# EAGLE design PCB-CMB-1 (EAGLE 6.4)

## Sheet 1 of 2
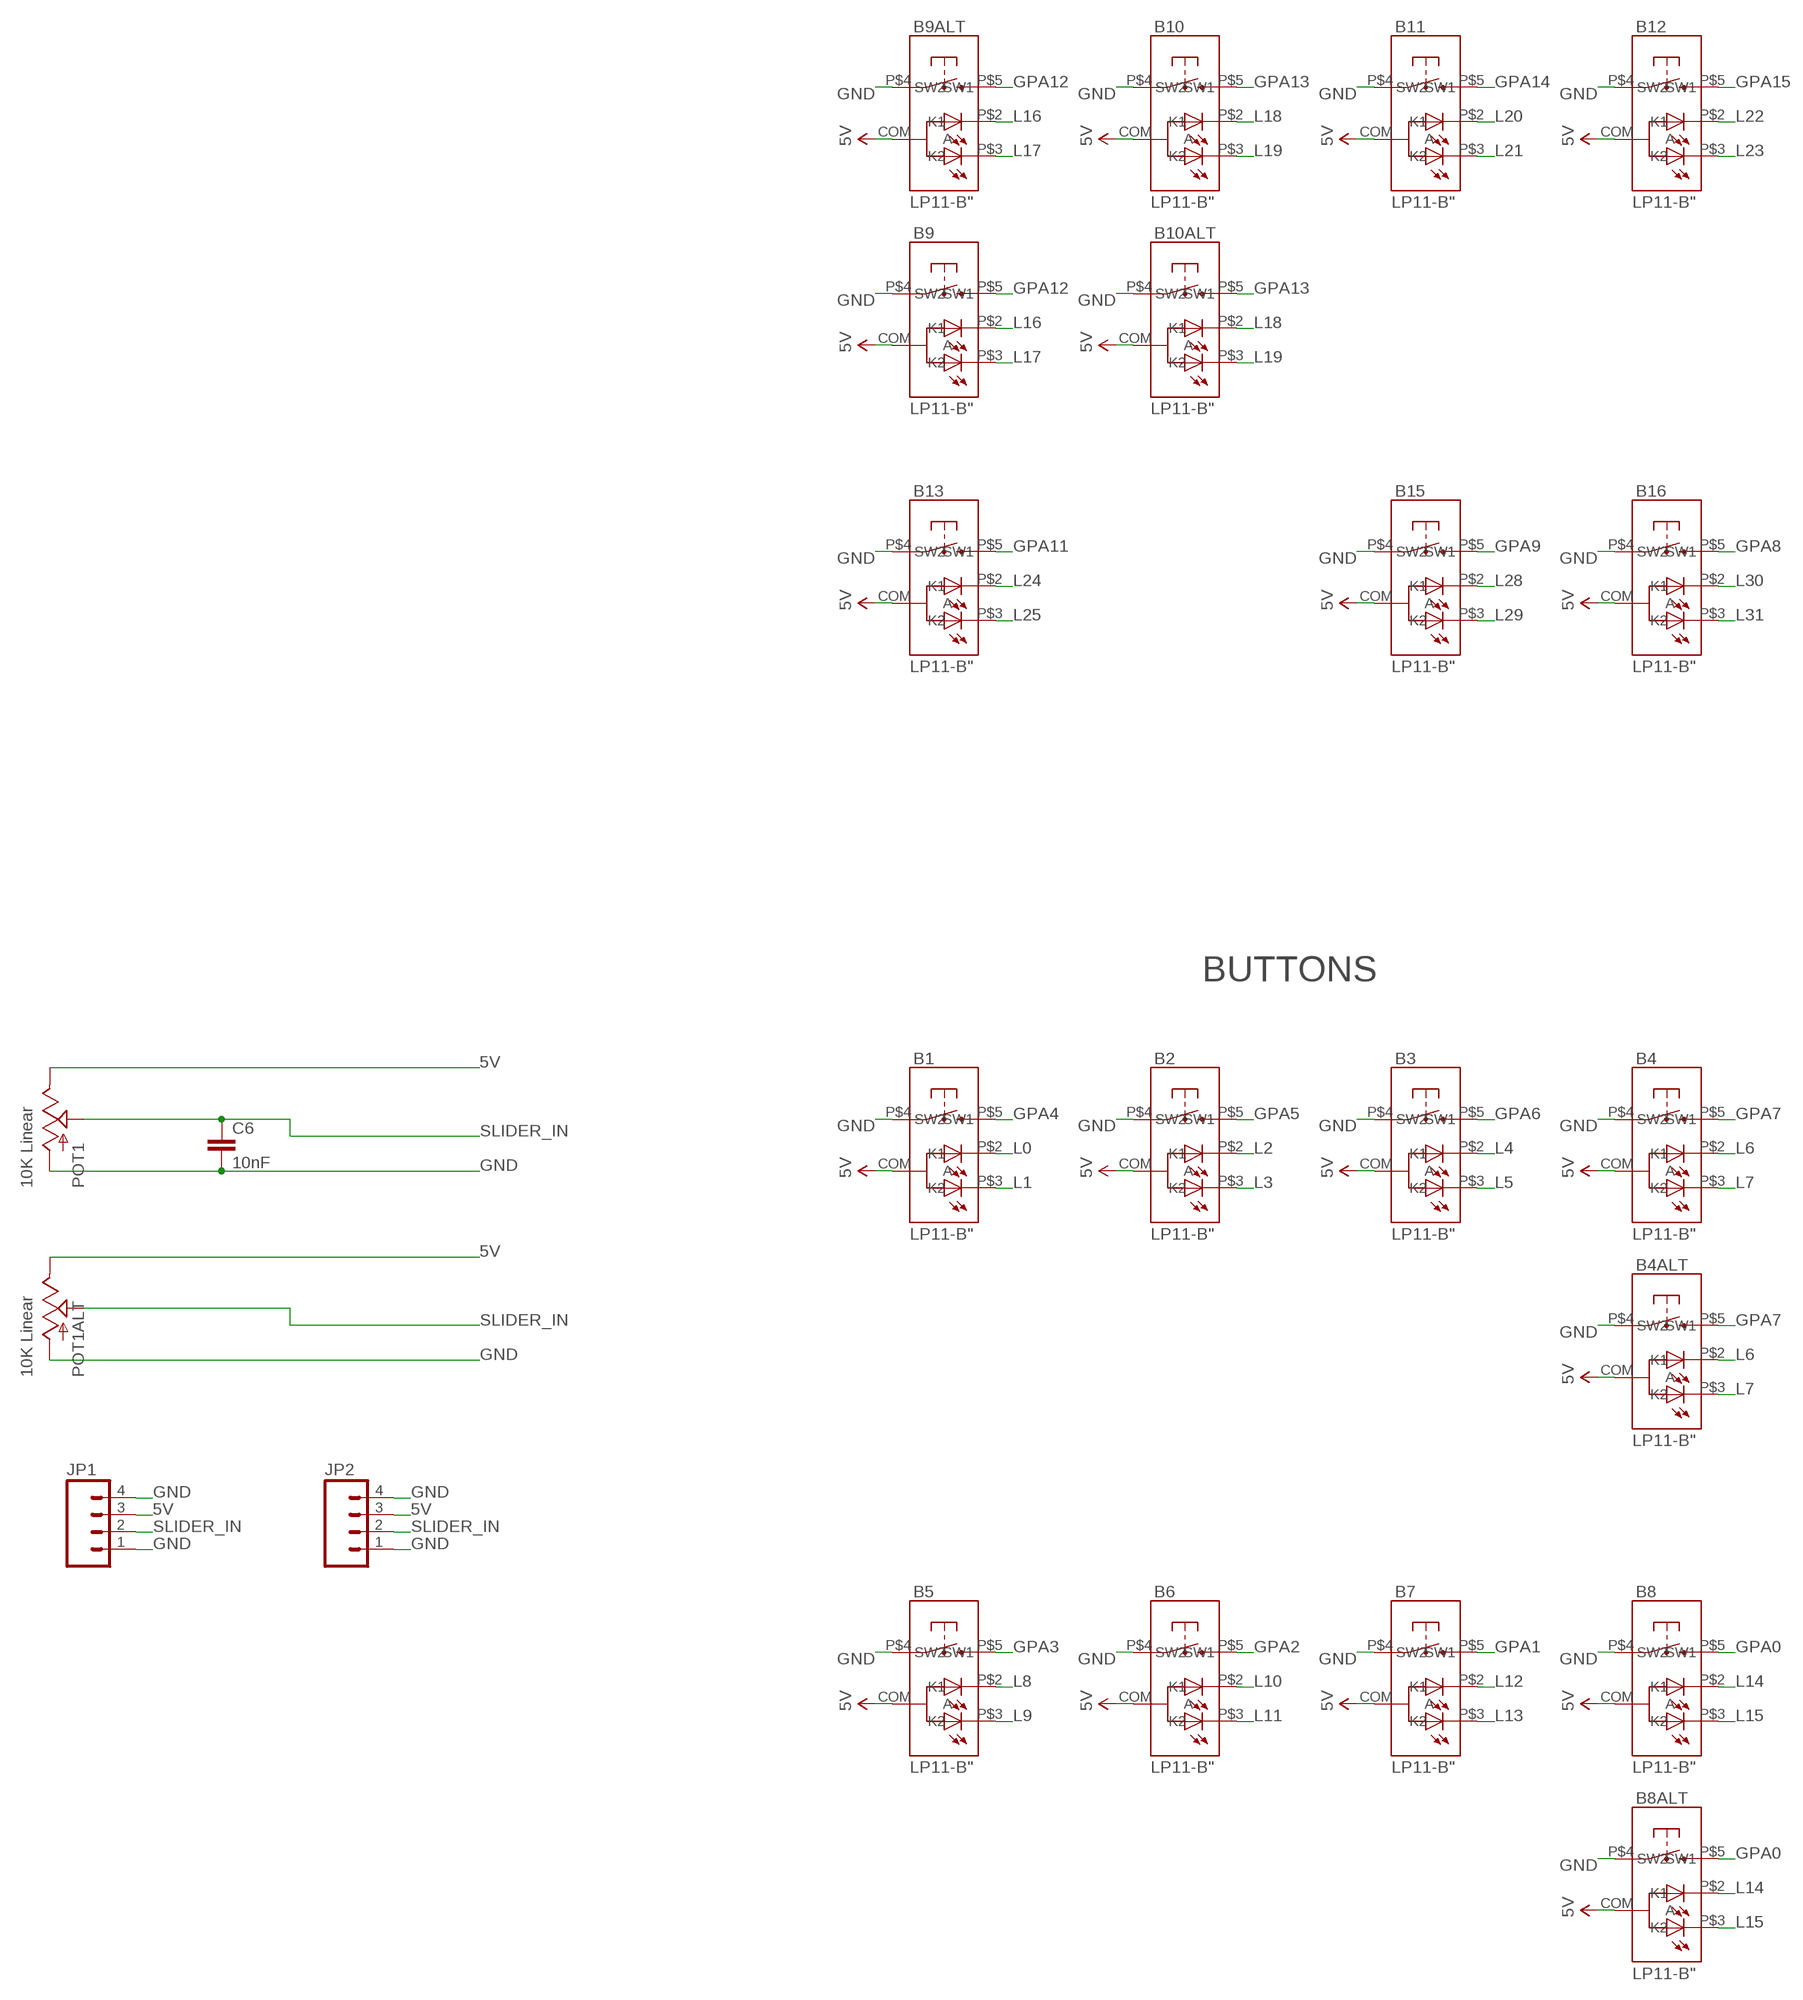
[diagram p0: schematic, sheet 1, part 1 of 2]
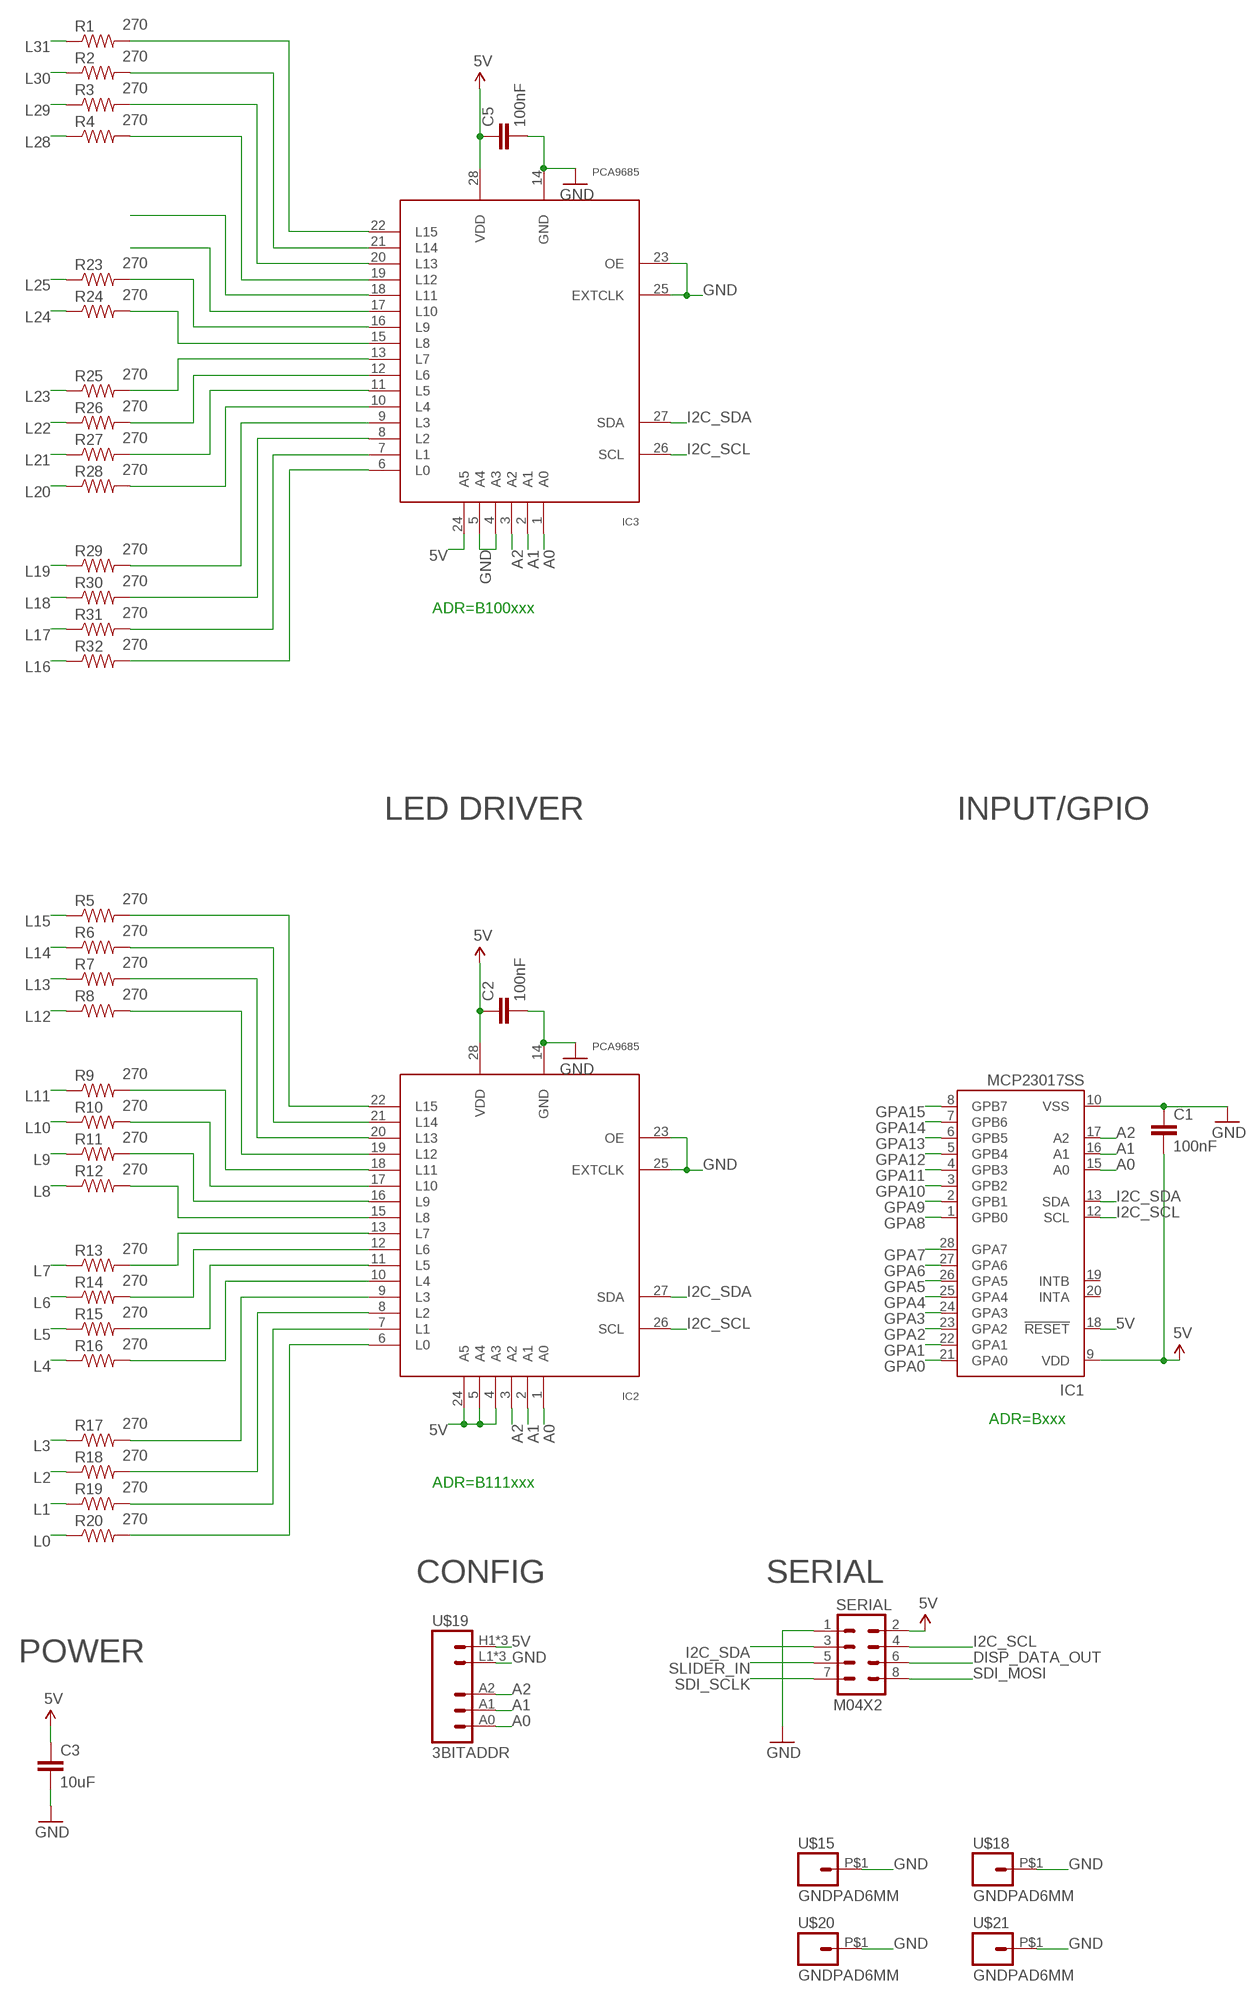
[diagram p1: schematic, sheet 1, part 2 of 2]

### Parts
B1  LP11-B"  [LP11]
B2  LP11-B"  [LP11]
B3  LP11-B"  [LP11]
B4  LP11-B"  [LP11]
B4ALT  LP11-B"  [LP11]
B5  LP11-B"  [LP11]
B6  LP11-B"  [LP11]
B7  LP11-B"  [LP11]
B8  LP11-B"  [LP11]
B8ALT  LP11-B"  [LP11]
B9  LP11-B"  [LP11]
B9ALT  LP11-B"  [LP11]
B10  LP11-B"  [LP11]
B10ALT  LP11-B"  [LP11]
B11  LP11-B"  [LP11]
B12  LP11-B"  [LP11]
B13  LP11-B"  [LP11]
B15  LP11-B"  [LP11]
B16  LP11-B"  [LP11]
C1  100nF  CAP0603-CAP  [0603-CAP]
C2  100nF  CAP0603-CAP  [0603-CAP]
C3  10uF  CAP0805  [0805]
C5  100nF  CAP0603-CAP  [0603-CAP]
C6  10nF  CAP0603-CAP  [0603-CAP]
IC1  MCP23017SS  [SSOP28]
IC2  PCA9685  [TSSOP28]
IC3  PCA9685  [TSSOP28]
JP1  M04PTH  [1X04]
JP2  M04PTH  [1X04]
POT1  10K Linear  SLIDER20  [SLIDER20]
POT1ALT  10K Linear  SLIDER20  [SLIDER20]
R1  270  RESISTOR0603-RES  [0603-RES]
R2  270  RESISTOR0603-RES  [0603-RES]
R3  270  RESISTOR0603-RES  [0603-RES]
R4  270  RESISTOR0603-RES  [0603-RES]
R5  270  RESISTOR0603-RES  [0603-RES]
R6  270  RESISTOR0603-RES  [0603-RES]
R7  270  RESISTOR0603-RES  [0603-RES]
R8  270  RESISTOR0603-RES  [0603-RES]
R9  270  RESISTOR0603-RES  [0603-RES]
R10  270  RESISTOR0603-RES  [0603-RES]
R11  270  RESISTOR0603-RES  [0603-RES]
R12  270  RESISTOR0603-RES  [0603-RES]
R13  270  RESISTOR0603-RES  [0603-RES]
R14  270  RESISTOR0603-RES  [0603-RES]
R15  270  RESISTOR0603-RES  [0603-RES]
R16  270  RESISTOR0603-RES  [0603-RES]
R17  270  RESISTOR0603-RES  [0603-RES]
R18  270  RESISTOR0603-RES  [0603-RES]
R19  270  RESISTOR0603-RES  [0603-RES]
R20  270  RESISTOR0603-RES  [0603-RES]
R23  270  RESISTOR0603-RES  [0603-RES]
R24  270  RESISTOR0603-RES  [0603-RES]
R25  270  RESISTOR0603-RES  [0603-RES]
R26  270  RESISTOR0603-RES  [0603-RES]
R27  270  RESISTOR0603-RES  [0603-RES]
R28  270  RESISTOR0603-RES  [0603-RES]
R29  270  RESISTOR0603-RES  [0603-RES]
R30  270  RESISTOR0603-RES  [0603-RES]
R31  270  RESISTOR0603-RES  [0603-RES]
R32  270  RESISTOR0603-RES  [0603-RES]
SERIAL  M04X2  [2X4]
U$15  GNDPAD6MM  [3.2MMPAD6MM]
U$18  GNDPAD6MM  [3.2MMPAD6MM]
U$19  3BITADDR  [3BITADDR]
U$20  GNDPAD6MM  [3.2MMPAD6MM]
U$21  GNDPAD6MM  [3.2MMPAD6MM]

### Nets
5V [Power]: B1.COM(A) B2.COM(A) B3.COM(A) B4.COM(A) B4ALT.COM(A) B5.COM(A) B6.COM(A) B7.COM(A) B8.COM(A) B8ALT.COM(A) B9.COM(A) B9ALT.COM(A) B10.COM(A) B10ALT.COM(A) B11.COM(A) B12.COM(A) B13.COM(A) B15.COM(A) B16.COM(A) C1.2 C2.1 C3.1 C5.1 IC1.9(VDD) IC1.18(!RESET) IC2.4(A3) IC2.5(A4) IC2.24(A5) IC2.28(VDD) IC3.24(A5) IC3.28(VDD) JP1.3 JP2.3 POT1.1(E) POT1ALT.1(E) SERIAL.2 U$19.H1(VCC) U$19.H2(VCC) U$19.H3(VCC)
A0: IC1.15(A0) IC2.1(A0) IC3.1(A0) U$19.A0
A1: IC1.16(A1) IC2.2(A1) IC3.2(A1) U$19.A1
A2: IC1.17(A2) IC2.3(A2) IC3.3(A2) U$19.A2
DISP_DATA_OUT: SERIAL.6
GND [Power]: B1.P$4(SW1) B2.P$4(SW1) B3.P$4(SW1) B4.P$4(SW1) B4ALT.P$4(SW1) B5.P$4(SW1) B6.P$4(SW1) B7.P$4(SW1) B8.P$4(SW1) B8ALT.P$4(SW1) B9.P$4(SW1) B9ALT.P$4(SW1) B10.P$4(SW1) B10ALT.P$4(SW1) B11.P$4(SW1) B12.P$4(SW1) B13.P$4(SW1) B15.P$4(SW1) B16.P$4(SW1) C1.1 C2.2 C3.2 C5.2 C6.2 IC1.10(VSS) IC2.14(GND) IC2.23(OE) IC2.25(EXTCLK) IC3.4(A3) IC3.5(A4) IC3.14(GND) IC3.23(OE) IC3.25(EXTCLK) JP1.1 JP1.4 JP2.1 JP2.4 POT1.3(A) POT1ALT.3(A) SERIAL.1 U$15.P$1 U$18.P$1 U$19.L1(GND) U$19.L2(GND) U$19.L3(GND) U$20.P$1 U$21.P$1
GPA0: B8.P$5(SW2) B8ALT.P$5(SW2) IC1.21(GPA0)
GPA1: B7.P$5(SW2) IC1.22(GPA1)
GPA2: B6.P$5(SW2) IC1.23(GPA2)
GPA3: B5.P$5(SW2) IC1.24(GPA3)
GPA4: B1.P$5(SW2) IC1.25(GPA4)
GPA5: B2.P$5(SW2) IC1.26(GPA5)
GPA6: B3.P$5(SW2) IC1.27(GPA6)
GPA7: B4.P$5(SW2) B4ALT.P$5(SW2) IC1.28(GPA7)
GPA8: B16.P$5(SW2) IC1.1(GPB0)
GPA9: B15.P$5(SW2) IC1.2(GPB1)
GPA10: IC1.3(GPB2)
GPA11: B13.P$5(SW2) IC1.4(GPB3)
GPA12: B9.P$5(SW2) B9ALT.P$5(SW2) IC1.5(GPB4)
GPA13: B10.P$5(SW2) B10ALT.P$5(SW2) IC1.6(GPB5)
GPA14: B11.P$5(SW2) IC1.7(GPB6)
GPA15: B12.P$5(SW2) IC1.8(GPB7)
I2C_SCL: IC1.12(SCL) IC2.26(SCL) IC3.26(SCL) SERIAL.4
I2C_SDA: IC1.13(SDA) IC2.27(SDA) IC3.27(SDA) SERIAL.3
L0: B1.P$2(K1) R20.1
L1: B1.P$3(K2) R19.1
L2: B2.P$2(K1) R18.1
L3: B2.P$3(K2) R17.1
L4: B3.P$2(K1) R16.1
L5: B3.P$3(K2) R15.1
L6: B4.P$2(K1) B4ALT.P$2(K1) R14.1
L7: B4.P$3(K2) B4ALT.P$3(K2) R13.1
L8: B5.P$2(K1) R12.1
L9: B5.P$3(K2) R11.1
L10: B6.P$2(K1) R10.1
L11: B6.P$3(K2) R9.1
L12: B7.P$2(K1) R8.1
L13: B7.P$3(K2) R7.1
L14: B8.P$2(K1) B8ALT.P$2(K1) R6.1
L15: B8.P$3(K2) B8ALT.P$3(K2) R5.1
L16: B9.P$2(K1) B9ALT.P$2(K1) R32.1
L17: B9.P$3(K2) B9ALT.P$3(K2) R31.1
L18: B10.P$2(K1) B10ALT.P$2(K1) R30.1
L19: B10.P$3(K2) B10ALT.P$3(K2) R29.1
L20: B11.P$2(K1) R28.1
L21: B11.P$3(K2) R27.1
L22: B12.P$2(K1) R26.1
L23: B12.P$3(K2) R25.1
L24: B13.P$2(K1) R24.1
L25: B13.P$3(K2) R23.1
L28: B15.P$2(K1) R4.1
L29: B15.P$3(K2) R3.1
L30: B16.P$2(K1) R2.1
L31: B16.P$3(K2) R1.1
N$1: IC3.13(L7) R25.2
N$2: IC3.12(L6) R26.2
N$3: IC3.11(L5) R27.2
N$4: IC2.13(L7) R13.2
N$5: IC2.12(L6) R14.2
N$6: IC3.10(L4) R28.2
N$7: IC2.11(L5) R15.2
N$8: IC3.9(L3) R29.2
N$9: IC2.10(L4) R16.2
N$10: IC2.9(L3) R17.2
N$11: IC2.8(L2) R18.2
N$12: IC2.7(L1) R19.2
N$13: IC3.8(L2) R30.2
N$14: IC3.7(L1) R31.2
N$15: IC3.6(L0) R32.2
N$16: IC3.15(L8) R24.2
N$17: IC3.16(L9) R23.2
N$18: IC3.17(L10)
N$19: IC2.6(L0) R20.2
N$20: IC2.15(L8) R12.2
N$21: IC2.16(L9) R11.2
N$22: IC2.17(L10) R10.2
N$23: IC2.18(L11) R9.2
N$24: IC2.19(L12) R8.2
N$25: IC2.20(L13) R7.2
N$26: IC2.21(L14) R6.2
N$27: IC2.22(L15) R5.2
N$28: IC3.18(L11)
N$29: IC3.19(L12) R4.2
N$30: IC3.20(L13) R3.2
N$31: IC3.21(L14) R2.2
N$32: IC3.22(L15) R1.2
SDI_MOSI: SERIAL.8
SDI_SCLK: SERIAL.7
SLIDER_IN: C6.1 JP1.2 JP2.2 POT1.2A(S) POT1ALT.2A(S) SERIAL.5
Unconnected: IC1.19(INTB) IC1.20(INTA)

### Notes on the sheet
- ADR=B100xxx
- BUTTONS | LED DRIVER | INPUT/GPIO
- ADR=Bxxx
- ADR=B111xxx
- CONFIG | SERIAL
- POWER

## Sheet 2 of 2

## Library data of the parts
B1-B4 B4ALT B5-B8 B8ALT B9 B9ALT B10 B10ALT B11-B13 B15 B16 = SKAARHOJ:LP11-B
C1-C3 C5 C6 = SparkFun:CAP: Capacitor Standard 0603 ceramic capacitor, and 0.1" leaded capacitor.
IC1 = microchip:MCP23017: http://ww1.microchip.com/downloads/en/DeviceDoc/21952a.pdf Source: http://ww1.microchip.com/downloads/en/DeviceDoc/21952a.pdf; MF: MICROCHIP; MPN: MCP23017-E/SS; OC_FARNELL: 1467674; OC_NEWARK: 31K2960
IC2 IC3 = wsmith:PCA9685
JP1 JP2 = SparkFun:M04: Header 4 Standard 4-pin 0.1" header. Use with straight break away headers (SKU : PRT-00116), right angle break away headers (PRT-00553), swiss pins (PRT-00743), machine pins (PRT-00117), and female headers (PRT-00115). Molex polarized connector foot print use with SKU : PRT-08231 with associated crimp pins and housings. 1MM SMD Version SKU: PRT-10208
POT1 POT1ALT = SKAARHOJ:SLIDER
R1-R20 R23-R32 = SparkFun:RESISTOR: Resistor Basic schematic elements and footprints for 0603, 1206, and PTH resistors.
SERIAL = SparkFun:M04X2
U$15 U$18 U$20 U$21 = SKAARHOJ:GNDPAD
U$19 = SKAARHOJ:3BITADDR

## Net classes
0 default: width 0.203 mm, drill 0.406 mm, clearance 0.203 mm
1 Power: width 0.406 mm, drill 0.61 mm, clearance 0.203 mm

## Board
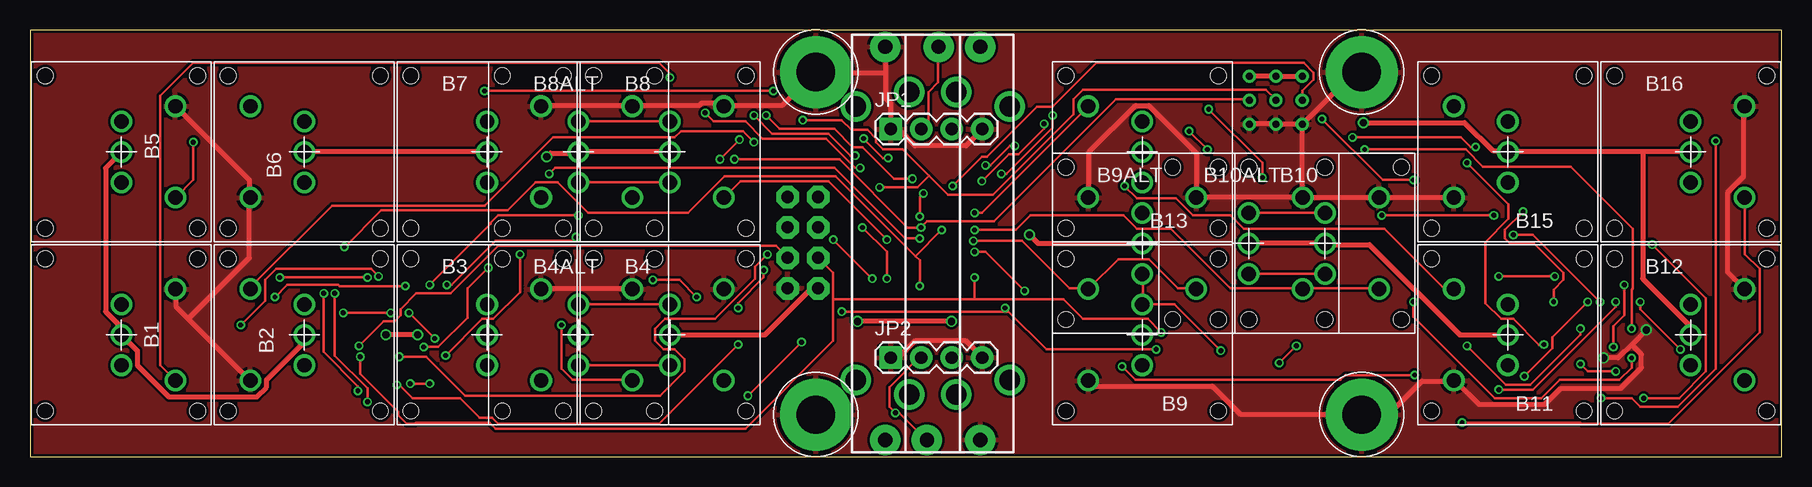
[diagram p2: board, top side]
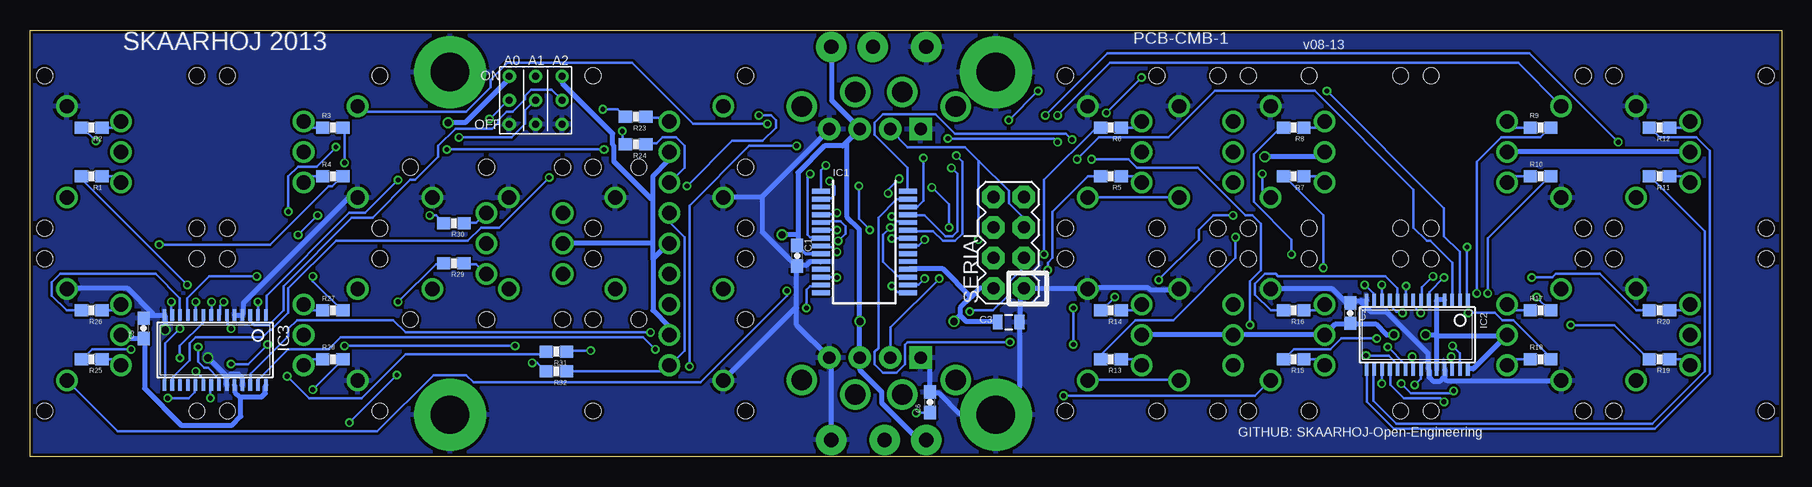
[diagram p3: board, bottom side, seen from below]

Size 146 x 35.56 mm. Coordinates in mm from the lower left corner, seen from the top.
Outline: 0,0 146,0 146,35.56 0,35.56 0,0
Copper layers (1*16): Top 0.035mm / dielectric 1.5mm / Bottom 0.035mm
Design rules "Fusion_eagle_rule_v1.1": minimum track width 6mil, minimum drill 12mil, track to track 6mil, track to pad 6mil, pad to pad 6mil, via to via 6mil, smd to smd 0mil, copper to edge 10mil, drill to drill 10mil, minimum pad ring 10mil, minimum via ring 6mil, stop-mask expansion 2mil, vias tented up to drill 100mil, thermal gap 10mil

### Footprints (pad centres in the part's own frame; a part is rotated, then mirrored left to right if it is on the bottom)
LP11 = drill 1.2: COM 0,0; P$2 0,2.54; P$3 0,-2.54; P$4 4.5,3.81; P$5 4.5,-3.81 | hole 1.3: -6.35,6.35; 6.35,6.35; 6.35,-6.35; -6.35,-6.35
0603-CAP = smd 1.1 x 1: 1 -0.85,0; 2 0.85,0
0805 = smd 0.8 x 1.2: 1 -0.9,0; 2 0.9,0
SSOP28 = smd 0.4 x 1.5: 1 -4.225,-3.625; 2 -3.575,-3.625; 3 -2.925,-3.625; 4 -2.275,-3.625; 5 -1.625,-3.625; 6 -0.975,-3.625; 7 -0.325,-3.625; 8 0.325,-3.625; 9 0.975,-3.625; 10 1.625,-3.625; 11 2.275,-3.625; 12 2.925,-3.625; 13 3.575,-3.625; 14 4.225,-3.625; 15 4.225,3.625; 16 3.575,3.625; 17 2.925,3.625; 18 2.275,3.625; 19 1.625,3.625; 20 0.975,3.625; 21 0.325,3.625; 22 -0.325,3.625; 23 -0.975,3.625; 24 -1.625,3.625; 25 -2.275,3.625; 26 -2.925,3.625; 27 -3.575,3.625; 28 -4.225,3.625
TSSOP28 = smd 0.305 x 0.991: 1 -4.225,-2.918; 2 -3.575,-2.918; 3 -2.925,-2.918; 4 -2.275,-2.918; 5 -1.625,-2.918; 6 -0.975,-2.918; 7 -0.325,-2.918; 8 0.325,-2.918; 9 0.975,-2.918; 10 1.625,-2.918; 11 2.275,-2.918; 12 2.925,-2.918; 13 3.575,-2.918; 14 4.225,-2.918; 15 4.225,2.918; 16 3.575,2.918; 17 2.925,2.918; 18 2.275,2.918; 19 1.625,2.918; 20 0.975,2.918; 21 0.325,2.918; 22 -0.325,2.918; 23 -0.975,2.918; 24 -1.625,2.918; 25 -2.275,2.918; 26 -2.925,2.918; 27 -3.575,2.918; 28 -4.225,2.918
1X04 = drill 1.016 pad 1.88 square: 1 0,0 | drill 1.016 pad 1.88: 2 2.54,0; 3 5.08,0; 4 7.62,0
SLIDER20 = drill 1.194 pad 2.54: 1 -16.383,1.74; 2A -16.383,-1.74; 3 16.383,1.74 | drill 1.702: P$1 -11.392,4.191; P$2 11.392,4.191; P$3 12.598,-4.191; P$4 -12.598,-4.191
0603-RES = smd 1.1 x 1: 1 -0.85,0; 2 0.85,0
2X4 = drill 1.016 pad 1.88 octagon: 1 -3.81,-1.27; 2 -3.81,1.27; 3 -1.27,-1.27; 4 -1.27,1.27; 5 1.27,-1.27; 6 1.27,1.27; 7 3.81,-1.27; 8 3.81,1.27
3.2MMPAD6MM = drill 3.2 pad 6: P$1 0,0
3BITADDR = drill 0.6: A0 -2.2,0; A1 0,0; A2 2.2,0; H1 -2.2,2; H2 0,2; H3 2.2,2; L1 -2.2,-2; L2 0,-2; L3 2.2,-2

### Placement (x,y rotation side)
B1  7.62,10.16 0 top
B2  22.86,10.16 180 top
B3  38.1,10.16 0 top
B4  53.34,10.16 0 top
B4ALT  45.72,10.16 0 top
B5  7.62,25.4 0 top
B6  22.86,25.4 180 top
B7  38.1,25.4 0 top
B8  53.34,25.4 0 top
B8ALT  45.72,25.4 0 top
B9  92.71,10.16 180 top
B9ALT  92.71,17.78 0 top
B10  107.95,17.78 0 top
B10ALT  101.6,17.78 0 top
B11  123.19,10.16 180 top
B12  138.43,10.16 0 top
B13  92.71,25.4 180 top
B15  123.19,25.4 180 top
B16  138.43,25.4 0 top
C1  82.04,16.75 90 bottom
C2  35.96,11.96 90 bottom
C3  64.42,11.21 0 bottom
C5  136.54,10.69 90 bottom
C6  70.97,4.54 90 bottom
IC1  76.45,17.89 270 bottom
IC2  30.37,10.16 180 bottom
IC3  130.57,8.89 180 bottom
JP1  71.75,27.3 0 top
JP2  71.75,8.26 0 top
POT1  73.03,17.78 90 top
POT1ALT  77.47,17.78 270 top
R1  140.86,23.37 180 bottom
R2  140.86,27.43 180 bottom
R3  120.76,27.43 0 bottom
R4  120.76,23.37 0 bottom
R5  55.9,23.37 180 bottom
R6  55.9,27.43 180 bottom
R7  40.66,23.37 180 bottom
R8  40.66,27.43 180 bottom
R9  20.08,27.43 0 bottom
R10  20.08,23.37 0 bottom
R11  10.18,23.37 180 bottom
R12  10.18,27.43 180 bottom
R13  55.9,8.13 180 bottom
R14  55.9,12.19 180 bottom
R15  40.66,8.13 180 bottom
R16  40.66,12.19 180 bottom
R17  20.08,12.19 0 bottom
R18  20.08,8.13 0 bottom
R19  10.18,8.13 180 bottom
R20  10.18,12.19 180 bottom
R23  95.52,28.32 180 bottom
R24  95.52,26.03 180 bottom
R25  140.86,8.13 180 bottom
R26  140.86,12.19 180 bottom
R27  120.76,12.19 0 bottom
R28  120.76,8.13 0 bottom
R29  110.68,16.13 180 bottom
R30  110.67,19.47 180 bottom
R31  102.12,8.76 180 bottom
R32  102.12,7.11 180 bottom
SERIAL  64.42,17.84 90 bottom
U$15  65.5,3.5 0 top
U$18  111,3.5 0 top
U$19  103.85,29.7 0 bottom
U$20  65.5,32.06 0 top
U$21  111,32.06 0 top

### Tracks (layer width: path | path; a pad name or v marks a point on that pad's centre or on a via)
5V  (via drill 0.61)
  Top 0.406: B16.COM 134.42,25.4 | 134.42,25.4 B15.COM 123.04,25.5 121.92,25.5 119.58,27.84 v111.15,27.84 | 134.42,25.4 134.42,14.83 138.38,10.87 138.38,10.16 B12.COM | B10ALT.COM B10.COM 108.1,17.68 111.66,17.68 119.18,10.16 B11.COM | U$19.H3 101.7,31.7 103.83,31.7 U$19.H2 104.04,31.7 105.97,31.7 U$19.H1 | B8.COM B8ALT.COM 45.62,25.3 43.38,25.3 v43.08,24.99 | B7.COM B6.COM | B5.COM 6.3,24.08 6.3,12.09 7.62,10.77 B1.COM 8.94,8.84 8.94,7.62 11.58,4.98 18.9,4.98 19.71,5.79 19.71,6.4 22.86,9.55 B2.COM | B4.COM 61.27,10.16 65.13,14.02 65.63,14.02 SERIAL.2 | v76.81,11.28 v68.99,11.28 | v32.31,10.16 v29.67,10.16 | B9ALT.COM 84.02,17.78 v83.31,18.49
  Bottom 0.305: IC1.9 81.36,16.91 C1.2
  Bottom 0.406: 128.42,4.98 128.52,4.98 128.93,5.38 128.93,5.89 IC3.24 | 128.42,4.98 126.69,4.98 126.39,5.28 126.39,5.89 IC3.28 | B12.COM 138.38,10.16 138.07,9.86 136.55,9.86 C5.1 136.45,9.65 136.45,5.69 133.4,2.64 129.13,2.64 128.42,3.35 128.42,4.98 | 93.98,16.56 92.76,17.78 B9ALT.COM | 93.98,16.56 94.08,16.46 94.08,12.19 92.76,10.87 92.76,10.16 B9.COM | 94.08,17.78 94.08,16.66 93.98,16.56 | 94.08,17.78 94.08,21.44 | 94.08,21.44 94.08,23.37 92.76,24.69 92.76,25.4 B13.COM | U$19.H3 101.6,31.6 101.6,31.09 97.43,26.92 97.43,26.01 97.33,25.91 97.33,24.59 94.18,21.44 94.08,21.44 | 94.08,17.78 B10ALT.COM | v111.15,27.84 109.73,27.84 105.97,31.6 U$19.H1 | v43.08,24.99 38.51,24.99 B7.COM | IC2.4 28.14,13.11 28.65,13.11 IC2.5 28.75,12.9 28.75,10.16 | 28.75,10.16 28.75,10.06 | 28.75,10.06 28.75,7.32 IC2.24 | IC2.28 26.11,7.32 25.7,7.32 B2.COM 23.16,10.06 28.75,10.06 | B5.COM B6.COM | 68.48,11.79 67.97,11.28 65.33,11.28 C3.1 | 68.48,11.79 68.48,12.39 67.56,13.31 | 67.56,13.31 66.85,14.02 65.73,14.02 SERIAL.2 | 67.56,13.31 69.9,15.65 72.75,15.65 IC1.18 | B4.COM B4ALT.COM B3.COM 37.19,11.07 35.97,11.07 C2.1 35.76,11.07 33.83,11.07 32.92,10.16 v32.31,10.16 | POT1.1 71.32,1.42 71.93,1.42 74.98,4.47 74.98,5.38 76.81,7.21 76.81,8.23 JP2.3 76.91,8.43 76.91,11.28 | 81.99,18.49 81.99,23.67 79.76,25.91 78.23,25.91 78.03,26.11 | 81.99,18.49 81.99,17.68 C1.2 | 78.03,26.11 JP1.3 76.91,27.43 79.15,29.67 79.15,34.14 POT1ALT.1 | 76.91,11.28 76.91,19 77.93,20.02 77.93,26.01 78.03,26.11 | v68.99,11.28 68.48,11.79 | v76.81,11.28 76.91,11.28 | v29.67,10.16 28.75,10.16 | 81.99,18.49 v83.31,18.49
A0  (via drill 0.41)
  Top 0.203: v115.32,23.06 112.78,23.06 v107.7,28.14 | v26.21,17.48 29.26,20.52 39.83,20.52 42.16,22.86 43.99,22.86 46.53,20.32 54.86,20.32 57.91,23.37 67.16,23.37 73.81,16.71 | 73.81,16.71 74.17,16.36 v74.17,14.22 | v76.91,22.55 79.35,24.99 79.76,24.99 83.92,29.16 85.24,29.16 88.9,32.82 106.17,32.82 106.98,32 106.98,31.39 106.07,30.48 106.07,29.77 U$19.A0 | 73.81,16.71 v76,18.9
  Bottom 0.203: v115.32,23.06 118.06,20.32 119.38,20.32 126.29,13.41 126.29,11.89 IC3.1 | v107.7,28.14 106.07,29.77 U$19.A0 | v26.21,17.48 26.21,13.11 IC2.1 | v74.17,14.22 73.66,13.72 72.85,13.72 IC1.15 | v76.91,22.55 76.91,19.81 v76,18.9
A1  (via drill 0.41)
  Top 0.203: v61.98,30.48 v37.9,30.48 | v64.41,28.04 67.67,28.04 68.48,27.23 69.8,27.23 70.51,26.52 70.51,26.21 71.12,25.6 72.75,25.6 74.93,23.42 | 74.93,23.42 76.5,21.84 80.26,21.84 86.97,28.55 86.97,29.77 87.78,30.58 103.02,30.58 103.83,29.77 U$19.A1 | v127,12.9 127,13.92 127.81,14.73 127.81,15.34 125.37,17.78 123.34,17.78 122.94,18.19 122.94,18.9 v124.46,20.42 | v120.5,25.81 120.09,25.81 119.28,26.62 v110.24,26.62 | v71.42,14.83 71.42,17.07 v69.39,19.1 | v70.81,22.45 73.97,22.45 74.93,23.42
  Bottom 0.203: v37.9,30.48 28.14,20.73 28.14,18.39 26.82,17.07 26.82,13.11 IC2.2 | v64.41,28.04 v61.98,30.48 | v127,12.9 127,11.89 IC3.2 | v124.46,20.42 124.46,23.37 123.65,24.18 122.12,24.18 v120.5,25.81 | v110.24,26.62 105.87,26.62 104.75,27.74 104.75,28.85 103.94,29.67 U$19.A1 | v71.42,14.83 71.93,14.33 72.75,14.33 IC1.16 | v69.39,19.1 69.39,21.03 v70.81,22.45
A2  (via drill 0.41)
  Top 0.203: v58.73,24.79 67.46,24.79 73.15,19.1 v74.27,19.1 74.78,19.61 80.37,19.61 90.53,29.77 101.6,29.77 U$19.A2
  Bottom 0.203: IC3.3 127.61,11.79 127.61,11.28 127.31,10.97 126.09,10.97 124.87,12.19 124.87,14.22 119.18,19.91 117.45,19.91 114.3,23.06 113.89,23.06 111.96,24.99 111.96,25.91 110.54,27.33 107.49,27.33 106.98,27.84 106.98,28.04 106.27,28.75 105.77,28.75 104.75,29.77 104.75,30.07 104.24,30.58 102.51,30.58 101.7,29.77 U$19.A2 | v58.73,24.79 56.9,26.62 51.1,26.62 47.24,30.48 38.91,30.48 30.68,22.25 30.68,19.1 29.57,17.98 29.26,17.98 27.43,16.15 27.43,13.11 IC2.3 | v74.27,19.1 74.88,18.49 74.88,16.26 73.66,15.04 72.85,15.04 IC1.17
GND  (via drill 0.61)
  Top 0.406: B5.P$4 12.19,29.16 18.29,23.06 18.29,21.64 B6.P$4 18.29,21.44 18.29,16.56 13.21,11.48 | 13.21,11.48 18.29,6.4 B2.P$4 | 13.21,11.48 12.19,12.5 12.19,13.92 B1.P$4 | B4ALT.P$4 50.19,14.02 42.67,14.02 B3.P$4 | U$19.L3 101.7,27.74 103.83,27.74 U$19.L2 104.04,27.74 105.97,27.74 U$19.L1 | B10ALT.P$4 106.07,21.64 97.23,21.64 B9ALT.P$4 97.23,21.84 97.23,25.3 93.27,29.26 92.15,29.26 88.29,25.4 88.29,21.64 B13.P$4 | B10ALT.P$4 106.27,21.64 112.37,21.64 B10.P$4 112.57,21.64 118.67,21.64 B15.P$4 | U$19.L1 106.07,27.53 106.07,21.84 B10ALT.P$4 | U$21.P$1 110.95,32 110.34,32 106.17,27.84 U$19.L1 | 71.32,32 71.32,34.14 POT1.3 | 71.32,32 71.32,29.87 71.73,29.46 71.73,27.33 JP1.1 71.93,27.23 72.44,27.23 73.76,25.91 78.03,25.91 79.35,27.23 JP1.4 | B7.P$4 42.67,29.26 50.19,29.26 B8ALT.P$4 50.39,29.26 55.78,29.26 55.98,29.46 57.91,29.46 B8.P$4 57.91,29.26 62.69,29.26 65.43,32 U$20.P$1 65.63,32 71.32,32 | v131.17,8.23 132.38,8.23 133.5,9.35 | v134.72,10.57 133.5,9.35 | B16.P$4 142.85,29.16 142.85,23.37 141.53,22.05 141.53,15.34 142.85,14.02 B12.P$4 | B9.P$4 88.29,6.3 88.7,5.89 98.55,5.89 100.89,3.56 110.85,3.56 U$18.P$1 111.05,3.56 113.28,3.56 116.03,6.3 118.67,6.3 B11.P$4 118.87,6.3 120.8,4.37 126.29,4.37 127.61,5.69 132.59,5.69 134.31,7.42 134.31,8.53 133.5,9.35 | JP2.1 71.83,8.33 72.44,8.33 73.76,9.65 78.03,9.65 79.35,8.33 JP2.4
  Bottom 0.406: 28.14,6.6 28.45,6.3 29.06,6.3 29.36,6.6 29.36,7.21 IC2.23 29.46,7.42 29.46,8.64 32.92,12.09 34.24,12.09 35.05,12.9 35.05,13.01 | 28.14,6.6 28.04,6.71 28.04,7.21 IC2.25 | 28.14,6.6 27.84,6.3 18.39,6.3 B2.P$4 | 35.05,13.01 35.76,13.01 35.87,12.9 C2.2 36.07,12.9 36.37,12.9 37.49,14.02 42.57,14.02 B3.P$4 | 35.05,13.01 34.65,13.01 IC2.14 | JP2.1 71.02,7.52 71.02,5.49 C6.2 70.81,5.28 70.21,5.28 68.48,3.56 65.53,3.56 U$15.P$1 65.53,3.76 63.5,5.79 63.5,11.07 C3.2 63.5,11.28 63.5,13.72 63.2,14.02 SERIAL.1 62.99,14.02 57.91,14.02 B4.P$4 57.71,14.12 52.83,14.12 52.63,13.92 50.29,13.92 B4ALT.P$4 | IC3.5 128.93,11.79 128.32,11.79 IC3.4 128.22,11.99 128.22,12.8 119.48,21.54 118.77,21.54 B15.P$4 | 129.54,6.6 129.64,6.5 129.64,5.99 IC3.23 | 129.54,6.6 129.24,6.91 128.63,6.91 128.32,6.6 128.32,5.99 IC3.25 | 135.74,11.79 136.25,11.79 136.45,11.58 C5.2 | 135.74,11.79 134.82,11.79 IC3.14 134.72,11.68 v134.72,10.57 | v131.17,8.23 129.54,6.6 | B12.P$4 142.85,14.02 137.87,14.02 135.74,11.89 135.74,11.79 | 85.04,21.64 88.19,21.64 B13.P$4 | JP1.4 85.04,21.64 | C1.1 81.99,15.95 81.28,15.95 80.97,16.26 80.16,16.26 IC1.10 | 82.09,12.39 82.09,10.97 JP2.4 79.25,8.13 79.25,1.42 POT1ALT.3 | 82.09,12.39 82.09,15.75 C1.1 | B9.P$4 88.19,6.4 82.19,12.39 82.09,12.39 | 85.04,21.64 84.94,21.54 84.94,18.69 82.19,15.95 C1.1
  pour Top: 0,0 146.05,0 146.05,35.56 0,35.56
  pour Bottom: 0,0 146.05,0 146.05,35.56 0,35.56
GPA0  (via drill 0.41)
  Top 0.203: v71.42,18.09 66.55,22.96 59.23,22.96 57.91,21.64 B8.P$5
  Bottom 0.203: v71.42,18.09 71.93,17.58 72.75,17.58 IC1.21 | B8ALT.P$5 50.29,21.64 57.81,21.64 B8.P$5
GPA1  (via drill 0.41)
  Top 0.203: v74.17,18.19 72.95,18.19 67.06,24.08 43.79,24.08 v43.28,23.57
  Bottom 0.203: v74.17,18.19 72.85,18.19 IC1.22 | v43.28,23.57 43.28,22.25 42.67,21.64 B7.P$5
GPA2  (via drill 0.41)
  Top 0.203: v68.78,25.09 68.38,25.09 66.55,26.92 61.87,26.92 v60.35,28.45
  Bottom 0.203: v68.78,25.09 68.28,24.59 68.28,18.59 68.89,17.98 69.9,17.98 70.71,18.8 72.75,18.8 IC1.23 | v60.35,28.45 55.98,32.82 21.95,32.82 18.39,29.26 B6.P$5
GPA3  (via drill 0.41)
  Top 0.203: v74.17,20.02 74.17,21.64 v74.47,21.95 | v73.56,23.16 72.03,23.16 69.39,25.81 68.58,25.81 67.06,27.33 62.48,27.33 v61.37,28.45 | v13.61,26.21 13.61,23.06 12.19,21.64 B5.P$5
  Bottom 0.203: v74.17,20.02 73.76,19.61 72.85,19.61 IC1.24 | v74.47,21.95 74.47,22.25 v73.56,23.16 | v61.37,28.45 56.19,33.63 21.03,33.63 v13.61,26.21
GPA4  (via drill 0.41)
  Top 0.203: v69.19,24.08 68.78,24.08 66.34,26.52 61.06,26.52 59.64,27.94 57,27.94 v56.29,28.65 | v53.34,31.6 53.34,31.9 52.43,32.82 13.61,32.82 10.87,30.07 10.87,7.62 12.09,6.4 B1.P$5
  Bottom 0.203: v69.19,24.08 68.68,23.57 68.68,18.8 69.09,18.39 69.7,18.39 71.42,20.12 72.75,20.12 IC1.25 | v53.34,31.6 v56.29,28.65
GPA5  (via drill 0.41)
  Top 0.203: v71.53,24.89 71.12,24.89 v69.49,26.52 | v60.35,26.21 59.44,27.13 54.25,27.13 53.75,26.62 43.59,26.62 37.9,20.93 25.2,20.93 18.29,14.02 B2.P$5
  Bottom 0.203: v71.53,24.89 71.53,21.34 72.03,20.83 72.75,20.83 IC1.26 | v69.49,26.52 60.66,26.52 v60.35,26.21
GPA6  (via drill 0.41)
  Top 0.203: v59.84,5.08 v64.31,9.55
  Bottom 0.203: v64.31,9.55 72.85,9.55 73.05,9.35 73.05,7.72 73.76,7.01 74.88,7.01 75.59,7.72 75.59,8.74 75.29,9.04 75.29,19.91 73.76,21.44 72.85,21.44 IC1.27 | v59.84,5.08 43.89,5.08 42.67,6.3 B3.P$5
GPA7  (via drill 0.41)
  Top 0.203: v57.51,24.79 v59.13,26.42 | v44.3,10.97 44.3,7.32 45.21,6.4 50.19,6.4 B4ALT.P$5
  Bottom 0.203: v59.13,26.42 59.64,26.92 68.89,26.92 70.51,28.55 74.88,28.55 75.59,27.84 75.59,26.82 72.85,24.08 72.85,22.15 IC1.28 | v57.51,24.79 54.46,24.79 53.75,24.08 48.67,24.08 44.7,20.12 44.09,20.12 43.38,19.41 43.38,15.54 44.3,14.63 v44.3,10.97 | B4.P$5 57.81,6.4 50.29,6.4 B4ALT.P$5
GPA8  (via drill 0.41)
  Top 0.203: v79.65,24.28 80.06,24.28 81.69,25.91 v82.09,25.91 | v91.03,7.52 92.15,6.4 109.22,6.4 109.63,6.81 v115.42,6.81 | v119.38,2.85 129.24,2.85 129.34,2.74 136.55,2.74 144.17,10.36 144.17,15.65 142.95,16.87 142.95,21.54 B16.P$5
  Bottom 0.203: v79.65,24.28 80.06,23.88 80.06,22.15 IC1.1 | v82.09,25.91 86.06,25.91 91.03,20.93 v91.03,7.52 | v119.38,2.85 v115.42,6.81
GPA9  (via drill 0.41)
  Top 0.203: v79.35,22.96 81.58,25.2 82.4,25.2 84.53,27.33 v84.53,27.74
  Bottom 0.203: v79.35,22.96 78.94,22.55 78.94,21.84 79.25,21.54 80.06,21.54 IC1.2 | v84.53,27.74 90.73,27.74 95.81,32.82 106.17,32.82 107.59,31.39 107.59,30.79 109.63,28.75 118.26,28.75 118.67,29.16 B15.P$5
GPA11  (via drill 0.41)
  Top 0.203: v78.74,20.32 79.35,20.32 88.19,29.16 B13.P$5
  Bottom 0.203: v78.74,20.32 78.84,20.22 80.06,20.22 IC1.4
GPA12  (via drill 0.41)
  Top 0.203: v78.64,17.98 82.7,17.98 86.67,14.02 88.19,14.02 B9.P$5 88.29,14.02 90.73,16.46 93.27,16.46 95.71,14.02 97.13,14.02 B9ALT.P$5
  Bottom 0.203: v78.64,17.98 78.03,18.59 78.03,19.2 78.44,19.61 80.06,19.61 IC1.5
GPA13  (via drill 0.41)
  Top 0.203: v78.74,18.9 82.19,18.9 83.41,20.12 91.14,20.12 92.25,19 95.1,19 100.08,14.02 106.07,14.02 B10ALT.P$5 106.17,14.02 112.37,14.02 B10.P$5
  Bottom 0.203: v78.74,18.9 80.06,18.9 IC1.6
GPA14  (via drill 0.41)
  Top 0.203: v80.97,23.57 81.38,23.57 85.24,27.43 v85.24,28.45 | v91.24,22.55 92.25,21.54 95.5,21.54 96.93,20.12 100.08,20.12 101.19,19 112.88,19 117.86,14.02 118.67,14.02 B11.P$5
  Bottom 0.203: v80.97,23.57 81.18,23.37 81.18,18.49 80.97,18.29 80.16,18.29 IC1.7 | v85.24,28.45 84.23,28.45 83.82,28.04 83.82,27.43 84.94,26.31 87.48,26.31 v91.24,22.55
GPA15  (via drill 0.41)
  Top 0.203: v78.74,17.07 79.65,17.07 v82.91,13.82
  Bottom 0.203: v78.74,17.07 79.15,17.48 80.06,17.48 IC1.8 | v82.91,13.82 82.91,13.41 90.12,6.2 109.02,6.2 109.63,6.81 112.37,6.81 117.04,2.13 138.68,2.13 142.85,6.3 B12.P$5
I2C_SCL  (via drill 0.41)
  Top 0.203: v27.53,8.33 27.53,6.91 30.68,3.76 30.68,3.45 31.39,2.74 32.11,2.74 32.21,2.85 38.3,2.85 38.81,2.34 59.64,2.34 66.95,9.65 66.95,13.11 | 66.95,13.11 66.95,15.34 65.73,16.56 SERIAL.4 | v94.28,10.36 93.17,11.48 87.78,11.48 86.16,13.11 78.74,13.11 | 66.95,13.11 78.74,13.11 | 78.74,13.11 v78.74,14.94
  Bottom 0.203: v27.53,8.33 27.53,7.32 IC2.26 | v94.28,10.36 114.71,10.36 115.72,11.38 123.75,11.38 124.46,10.67 124.46,10.06 127.61,6.91 127.61,5.99 IC3.26 | v78.74,14.94 80.06,14.94 IC1.12
I2C_SDA  (via drill 0.41)
  Top 0.203: v27.43,9.25 29.46,11.28 30.38,11.28 30.89,11.79 30.89,12.29 32.21,13.61 35.05,13.61 39.01,17.58 62.18,17.58 63.09,16.66 SERIAL.3 | v93.88,8.94 84.73,8.94 81.53,12.14 | v81.28,12.39 81.53,12.14 | v67.67,12.09 81.48,12.09 81.53,12.14
  Bottom 0.203: v27.43,9.25 26.82,8.64 26.82,7.32 IC2.27 | v93.88,8.94 94.89,9.96 120.09,9.96 121.11,8.94 124.46,8.94 127,6.4 127,5.99 IC3.27 | v81.28,12.39 81.28,13.92 80.97,14.22 80.16,14.22 IC1.13 | v67.67,12.09 67.56,12.19 65.73,12.19 64.41,13.51 64.41,14.53 63.2,15.75 63.2,16.56 SERIAL.3
L0
  Bottom 0.203: R20.1 8.13,12.19 B1.P$2
L1
  Bottom 0.203: R19.1 8.13,8.13 B1.P$3
L2
  Bottom 0.203: R18.1 22.35,8.13 B2.P$2
L3
  Bottom 0.203: R17.1 22.35,12.19 B2.P$3
L4
  Bottom 0.203: R16.1 38.61,12.19 B3.P$2
L5
  Bottom 0.203: R15.1 38.61,8.13 B3.P$3
L6
  Top 0.203: B4.P$2 B4ALT.P$2
  Bottom 0.203: R14.1 53.85,12.19 B4.P$2
L7
  Top 0.203: B4.P$3 B4ALT.P$3
  Bottom 0.203: R13.1 53.85,8.13 B4.P$3
L8
  Bottom 0.203: R12.1 8.13,27.43 B5.P$2
L9
  Bottom 0.203: R11.1 8.13,23.37 B5.P$3
L10
  Bottom 0.203: R10.1 22.35,23.37 B6.P$2
L11
  Bottom 0.203: R9.1 22.35,27.43 B6.P$3
L12
  Bottom 0.203: R8.1 38.61,27.43 B7.P$2
L13
  Bottom 0.203: R7.1 38.61,23.37 B7.P$3
L14
  Top 0.203: B8.P$2 B8ALT.P$2
  Bottom 0.203: R6.1 53.85,27.43 B8.P$2
L15
  Top 0.203: B8.P$3 B8ALT.P$3
  Bottom 0.203: R5.1 53.85,23.37 B8.P$3
L16
  Bottom 0.203: R32.1 93.27,7.11 92.76,7.62 B9.P$2 92.66,7.62 91.44,8.84 91.44,18.29 92.66,19.51 92.66,20.32 B9ALT.P$2
L17  (via drill 0.41)
  Top 0.203: v99.26,8.84 95.4,12.7 92.76,12.7 | 92.76,12.7 92.76,15.24 B9ALT.P$3 | 92.76,12.7 B9.P$3
  Bottom 0.203: v99.26,8.84 101.19,8.84 R31.1
L18
  Top 0.203: B10.P$2 B10ALT.P$2
  Bottom 0.203: R30.1 109.73,19.51 108.81,19.51 108,20.32 B10.P$2
L19
  Top 0.203: B10.P$3 B10ALT.P$3
  Bottom 0.203: R29.1 109.83,16.05 108.81,16.05 108,15.24 B10.P$3
L20
  Bottom 0.203: R28.1 122.63,8.13 123.14,7.62 B11.P$2
L21
  Bottom 0.203: R27.1 122.63,12.19 123.14,12.7 B11.P$3
L22
  Bottom 0.203: R26.1 138.99,12.19 138.48,12.7 B12.P$2
L23
  Bottom 0.203: R25.1 138.99,8.13 138.48,7.62 B12.P$3
L24
  Bottom 0.203: R24.1 94.59,26.11 93.78,26.11 93.27,26.62 92.15,26.62 91.44,25.91 91.44,24.08 92.66,22.86 B13.P$2
L25
  Bottom 0.203: R23.1 94.59,28.25 93.07,28.25 92.76,27.94 B13.P$3
L28
  Bottom 0.203: R4.1 122.63,23.37 123.14,22.86 B15.P$2
L29
  Bottom 0.203: R3.1 122.63,27.43 123.14,27.94 B15.P$3
L30
  Bottom 0.203: R2.1 138.99,27.43 138.48,27.94 B16.P$2
L31
  Bottom 0.203: R1.1 138.99,23.37 138.48,22.86 B16.P$3
N$1  (via drill 0.41)
  Top 0.203: v134.21,12.9 134.21,12.29 v137.57,8.94
  Bottom 0.203: v134.21,12.9 134.21,11.89 IC3.13 | v137.57,8.94 140.82,8.94 141.63,8.13 R25.2
N$2
  Bottom 0.203: R26.2 142.95,12.19 144.17,13.41 144.17,14.53 143.46,15.24 135.53,15.24 133.5,13.21 133.5,11.89 IC3.12
N$3  (via drill 0.41)
  Top 0.203: v122.43,15.04 v127.1,15.04
  Bottom 0.203: v127.1,15.04 131.06,15.04 132.89,13.21 132.89,11.89 IC3.11 | v122.43,15.04 122.43,14.63 119.99,12.19 R27.2
N$4  (via drill 0.41)
  Top 0.203: v34.75,14.33 35.15,14.33 38.81,17.98 45.21,17.98 v45.52,18.29
  Bottom 0.203: v34.75,14.33 34.04,13.61 34.04,13.11 IC2.13 | v45.52,18.29 45.52,16.56 50.7,11.38 53.85,11.38 56.69,8.53 56.69,8.13 R13.2
N$5  (via drill 0.41)
  Top 0.203: v33.33,14.33 38.41,19.41 38.41,19.51 39.01,20.12 v45.72,20.12 | v51.92,14.73 54.15,14.73 v55.58,13.31
  Bottom 0.203: v33.33,14.33 33.33,13.11 IC2.12 | v45.72,20.12 47.35,20.12 48.56,18.9 48.56,18.09 v51.92,14.73 | v55.58,13.31 56.69,12.19 R14.2
N$6  (via drill 0.41)
  Top 0.203: v132.18,12.9 132.18,12.5 125.27,5.59 v122.43,5.59
  Bottom 0.203: v132.18,12.9 132.18,11.89 IC3.10 | v122.43,5.59 119.89,8.13 R28.2
N$7  (via drill 0.41)
  Top 0.203: v33.73,9.86 v31.6,11.99
  Bottom 0.203: v31.6,11.99 31.7,12.09 32.11,12.09 32.61,12.6 32.61,13.01 IC2.11 | v33.73,9.86 36.68,9.86 37.59,8.94 40.64,8.94 41.45,8.13 R15.2
N$8  (via drill 0.41)
  Top 0.203: v133.5,8.23 133.5,7.42 132.49,6.4 127.51,6.4 125.98,4.88 122.12,4.88 115.32,11.68 v115.32,12.9
  Bottom 0.203: v133.5,8.23 133.5,9.25 131.57,11.18 131.57,11.79 IC3.9 | v115.32,12.9 112.17,16.05 111.56,16.05 R29.2
N$9
  Bottom 0.203: R16.2 42.57,12.19 43.89,13.51 43.89,14.43 43.08,15.24 42.16,15.24 41.96,15.04 33.02,15.04 32,14.02 32,13.11 IC2.10
N$10  (via drill 0.41)
  Top 0.203: v31.29,14.22 25.81,14.22 25.7,14.33 21.44,14.33 v20.42,13.31
  Bottom 0.203: v31.29,14.22 31.29,13.11 IC2.9 | v20.42,13.31 19.3,12.19 R17.2
N$11  (via drill 0.41)
  Top 0.203: v26.11,11.99 v30.07,11.99
  Bottom 0.203: v30.07,11.99 30.68,12.6 30.68,13.01 IC2.8 | v26.11,11.99 23.88,11.99 23.27,11.38 22.35,11.38 19.3,8.33 19.3,8.13 R18.2
N$12  (via drill 0.41)
  Top 0.203: v29.06,15.04 28.45,15.65 20.52,15.65 19.61,14.73 19.61,13.01 v17.58,10.97
  Bottom 0.203: v29.06,15.04 29.97,14.12 29.97,13.11 IC2.7 | v17.58,10.97 13.92,10.97 11.07,8.13 R19.2
N$13  (via drill 0.41)
  Top 0.203: v130.86,12.9 125.27,18.49 v123.65,18.49 | v112.67,20.12 v122.02,20.12
  Bottom 0.203: v130.86,12.9 130.86,11.89 IC3.8 | v122.02,20.12 v123.65,18.49 | v112.67,20.12 112.17,20.12 111.56,19.51 R30.2
N$14  (via drill 0.41)
  Top 0.203: v129.84,12.9 126.9,9.96 126.9,9.04 v124.56,6.71
  Bottom 0.203: v129.84,12.9 130.15,12.6 130.15,11.89 IC3.7 | v124.56,6.71 122.73,4.88 118.36,4.88 114.71,8.53 103.23,8.53 103.02,8.74 R31.2
N$15  (via drill 0.41)
  Top 0.203: v129.24,10.67 129.24,10.16 125.07,5.99 123.04,5.99 v119.79,9.25 | v104.14,7.82 v105.56,9.25
  Bottom 0.203: v129.24,10.67 129.24,10.77 129.54,11.07 129.54,11.79 IC3.6 | v105.56,9.25 v119.79,9.25 | v104.14,7.82 103.73,7.82 103.02,7.11 R32.2
N$16  (via drill 0.41)
  Top 0.203: v133.5,10.67 133.5,13.92 133.6,14.02 133.6,19 128.42,24.18 121.11,24.18 119.69,25.6 v111.25,25.6 | v96.62,27.13 v98.15,25.6
  Bottom 0.203: v133.5,10.67 134.72,9.45 134.72,5.99 IC3.15 | v98.15,25.6 v111.25,25.6 | v96.62,27.13 96.62,26.31 96.42,26.11 R24.2
N$17  (via drill 0.41)
  Top 0.203: v102.72,23.27 102.72,24.49 v98.25,28.96
  Bottom 0.203: v102.72,23.27 106.88,19.1 108.41,19.1 109.53,17.98 120.5,17.98 124.46,14.02 124.46,11.99 125.88,10.57 125.98,10.57 126.59,9.96 132.18,9.96 132.69,9.45 132.69,8.03 134.11,6.6 134.11,5.99 IC3.16 | v98.25,28.96 97.03,28.96 96.42,28.35 R23.2
N$19  (via drill 0.41)
  Top 0.203: v20.83,14.94 v28.14,14.94
  Bottom 0.203: v28.14,14.94 29.36,13.72 29.36,13.11 IC2.6 | v20.83,14.94 19.1,14.94 18.8,15.24 15.14,15.24 12.09,12.19 R20.2
N$20
  Bottom 0.203: IC2.15 34.54,7.21 34.54,4.57 32.31,2.34 10.57,2.34 5.99,6.91 5.99,25.5 7.11,26.62 10.16,26.62 10.97,27.43 R12.2
N$21
  Bottom 0.203: IC2.16 34.04,7.21 34.04,4.67 32.11,2.74 10.77,2.74 6.4,7.11 6.4,18.8 10.97,23.37 R11.2
N$22  (via drill 0.41)
  Top 0.203: v31.7,6.1 v33.33,6.1 | v27.33,5.49 27.33,5.89 24.49,8.74 v24.49,13.61
  Bottom 0.203: v33.33,6.1 33.33,7.21 IC2.17 | v31.7,6.1 30.89,5.28 27.53,5.28 v27.33,5.49 | v24.49,13.61 24.49,18.19 19.3,23.37 R10.2
N$23  (via drill 0.41)
  Top 0.203: v28.14,4.57 28.14,5.69 25.4,8.43 v25.4,13.61
  Bottom 0.203: v28.14,4.57 28.45,4.88 31.5,4.88 32.61,5.99 32.61,7.21 IC2.18 | v25.4,13.61 25.4,24.59 23.37,26.62 20.12,26.62 19.3,27.43 R9.2
N$24  (via drill 0.41)
  Top 0.203: v34.65,8.43 37.69,11.48 38.61,11.48 40.84,13.72 v40.84,16.87
  Bottom 0.203: v34.65,8.43 32.72,8.43 32,7.72 32,7.32 IC2.19 | v40.84,16.87 40.84,18.09 43.99,21.23 43.99,25.2 41.76,27.43 R8.2
N$25  (via drill 0.41)
  Top 0.203: v32.82,9.14 34.04,9.14 36.47,11.58 36.47,14.02 v38.2,15.75
  Bottom 0.203: v32.82,9.14 31.39,7.72 31.39,7.32 IC2.20 | v38.2,15.75 38.2,20.12 41.45,23.37 R7.2
N$26  (via drill 0.41)
  Top 0.203: v30.79,8.33 33.02,8.33 36.27,5.08 52.53,5.08 54.56,7.11 54.56,8.13 53.75,8.94 52.83,8.94 52.12,9.65 52.12,10.67 52.93,11.48 57.1,11.48 60.45,14.83 60.45,15.85 v61.47,16.87
  Bottom 0.203: v30.79,8.33 30.79,7.32 IC2.21 | v61.47,16.87 61.47,23.06 57.1,27.43 R6.2
N$27  (via drill 0.41)
  Top 0.203: v30.58,5.99 30.79,5.99 31.9,4.88 35.87,4.88 37.49,3.25 38.51,3.25 39.01,2.74 52.43,2.74 v59.03,9.35 | v59.03,12.39 59.03,12.8 61.16,14.94 v61.16,15.54
  Bottom 0.203: v30.58,5.99 30.07,6.5 30.07,7.21 IC2.22 | v59.03,12.39 v59.03,9.35 | v61.16,15.54 61.16,16.15 60.76,16.56 60.76,20.42 57.81,23.37 R5.2
N$29  (via drill 0.41)
  Top 0.203: v134.52,4.88 137.47,4.88 139.7,7.11 139.7,13.21 v135.23,17.68
  Bottom 0.203: v134.52,4.88 132.79,4.88 132.28,5.38 132.28,5.89 IC3.19 | v135.23,17.68 125.98,17.68 121.11,22.55 120.8,22.55 119.99,23.37 R4.2
N$30  (via drill 0.41)
  Top 0.203: v132.18,7.11 129.84,7.11 v129.24,7.72 | v126.19,9.35 125.78,9.35 123.65,11.48 122.63,11.48 121.31,12.8 121.31,17.88 123.24,19.81 123.24,21.03 v119.79,24.49
  Bottom 0.203: v132.18,7.11 131.57,6.5 131.57,5.99 IC3.20 | v129.24,7.72 127.81,7.72 v126.19,9.35 | v119.79,24.49 119.79,27.33 119.89,27.43 R3.2
N$31  (via drill 0.41)
  Top 0.203: v130.96,4.88 133.5,4.88 134.21,4.17 137.36,4.17 140.51,7.32 v140.51,26.31
  Bottom 0.203: v130.96,4.88 130.96,5.89 IC3.21 | v140.51,26.31 141.63,27.43 R2.2
N$32  (via drill 0.41)
  Top 0.203: v131.98,9.14 131.98,10.87 132.89,11.79 v132.89,14.33
  Bottom 0.203: v131.98,9.14 131.98,7.92 131.47,7.42 131.17,7.42 130.25,6.5 130.25,5.99 IC3.22 | v132.89,14.33 141.63,23.06 141.63,23.37 R1.2
SLIDER_IN  (via drill 0.41)
  Top 0.203: POT1.2A 74.68,1.42 72.44,3.66 v72.14,3.66 71.63,4.17 71.63,5.79 74.07,8.23 74.27,8.23 JP2.2 | POT1ALT.2A 75.69,34.14 75.69,31.19 74.88,30.38 74.88,27.84 74.37,27.33 JP1.2 | v66.95,18.09 v70.21,14.83
  Bottom 0.203: v72.14,3.66 71.02,3.66 C6.1 | 66.9,24.64 68.07,25.81 72.85,25.81 74.27,27.23 JP1.2 | 66.9,24.64 64.41,22.15 64.41,21.13 63.2,19.91 63.2,19.2 SERIAL.5 | v70.21,14.83 74.27,10.77 74.27,8.33 JP2.2 | v66.95,18.09 66.95,24.59 66.9,24.64

### Text on the board
_bsilk: v08-13 | PCB-CMB-1 | SKAARHOJ 2013 | GITHUB: SKAARHOJ-Open-Engineering